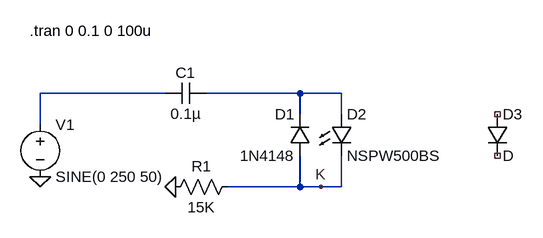
[diagram p0: schematic Draft1.asc]
Draft1.asc, the LTspice schematic file:
Version 4
SHEET 1 880 680
WIRE 80 112 -112 112
WIRE 288 112 144 112
WIRE 352 112 288 112
WIRE 288 144 288 112
WIRE 352 144 352 112
WIRE -112 160 -112 112
WIRE 288 256 288 208
WIRE 288 256 176 256
WIRE 320 256 288 256
WIRE 352 256 352 208
WIRE 352 256 320 256
FLAG -112 240 0
FLAG 96 256 0
FLAG 320 256 K
SYMBOL voltage -112 144 R0
WINDOW 123 0 0 Left 0
WINDOW 39 0 0 Left 0
SYMATTR InstName V1
SYMATTR Value SINE(0 250 50)
SYMBOL res 192 240 R90
WINDOW 0 0 56 VBottom 2
WINDOW 3 32 56 VTop 2
SYMATTR InstName R1
SYMATTR Value 15K
SYMATTR SpiceLine tol=1 pwr=0.1
SYMBOL diode 304 208 R180
WINDOW 0 24 64 Left 2
WINDOW 3 24 0 Left 2
SYMATTR InstName D1
SYMATTR Value 1N4148
SYMBOL LED 336 144 R0
SYMATTR InstName D2
SYMATTR Value NSPW500BS
SYMBOL cap 144 96 R90
WINDOW 0 0 32 VBottom 2
WINDOW 3 32 32 VTop 2
SYMATTR InstName C1
SYMATTR Value 0.1µ
SYMATTR SpiceLine V=630 Irms=556m Rser=0.01433 Lser=0 mfg="KEMET" pn="C1812C104KBRAC" type="X7R"
SYMBOL diode 576 144 R0
SYMATTR InstName D3
TEXT -128 16 Left 2 !.tran 0 0.1 0 100u

The netlist it stands for:
* Draft1.asc
V1 N001 0 SINE(0 250 50)
R1 K 0 15K tol=1 pwr=0.1
D1 K N002 1N4148
D2 N002 K NSPW500BS
C1 N002 N001 0.1µ V=630 Irms=556m Rser=0.01433 Lser=0 mfg="KEMET" pn="C1812C104KBRAC" type="X7R"
D3 NC_01 NC_02 D
.model D D
.lib standard.dio
.tran 0 0.1 0 100u
.backanno
.end